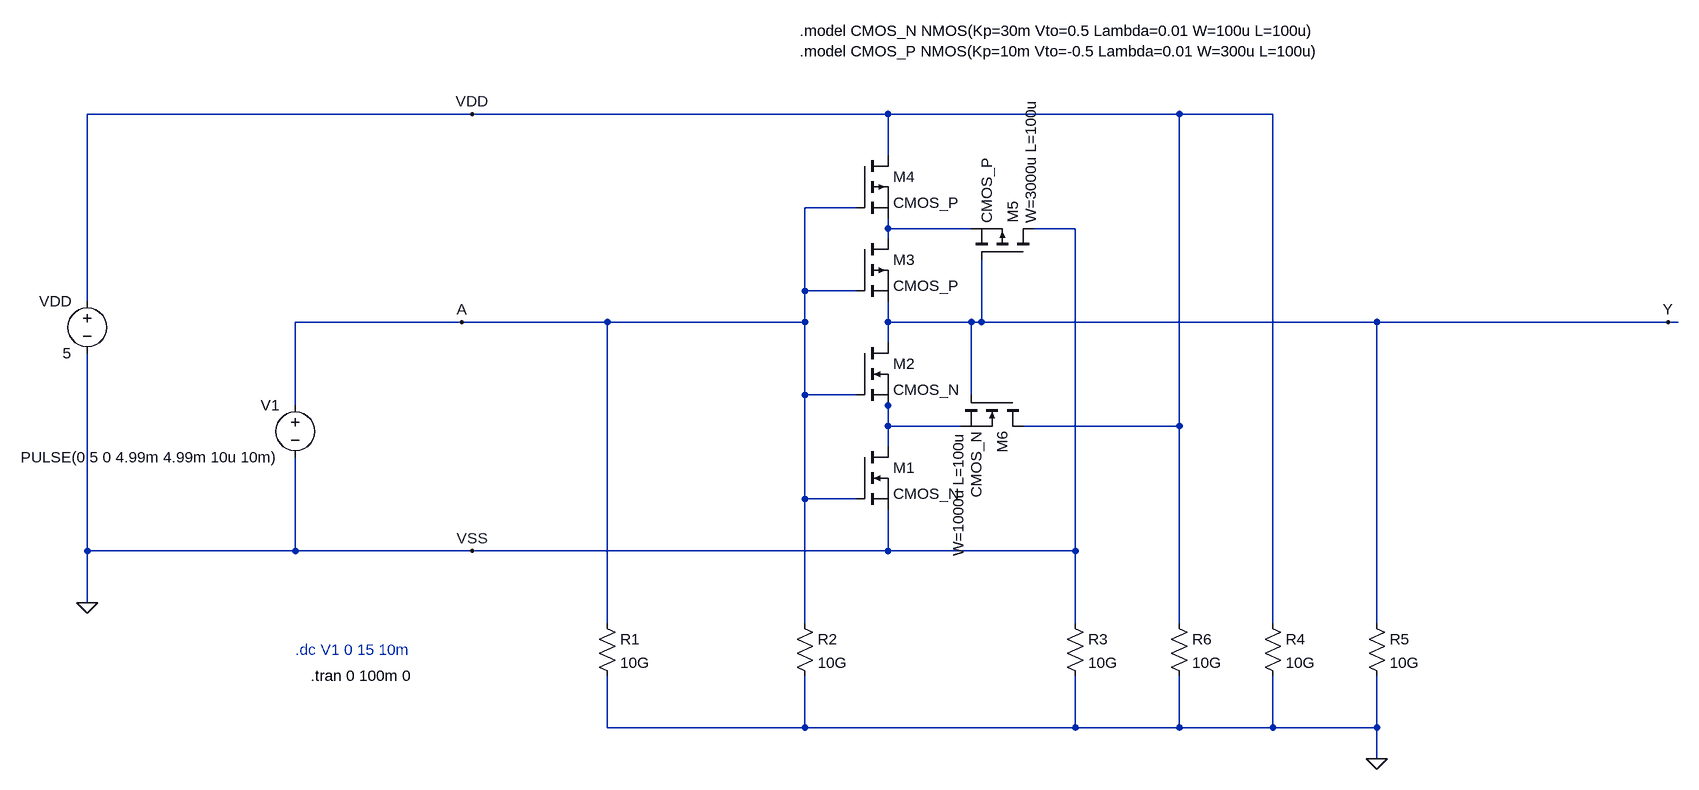
[diagram p0: schematic SN74AC14_Transistor_Level_SPICE_Model.asc]
SN74AC14_Transistor_Level_SPICE_Model.asc, the LTspice schematic file:
Version 4.1
SHEET 1 1144 756
WIRE -864 -256 -1456 -256
WIRE -224 -256 -864 -256
WIRE 224 -256 -224 -256
WIRE 368 -256 224 -256
WIRE -224 -192 -224 -256
WIRE -272 -112 -352 -112
WIRE -224 -80 -224 -96
WIRE -96 -80 -224 -80
WIRE 64 -80 0 -80
WIRE -224 -64 -224 -80
WIRE -352 16 -352 -112
WIRE -272 16 -352 16
WIRE -1456 32 -1456 -256
WIRE -880 64 -1136 64
WIRE -656 64 -880 64
WIRE -352 64 -352 16
WIRE -352 64 -656 64
WIRE -224 64 -224 32
WIRE -96 64 -224 64
WIRE -80 64 -80 -32
WIRE -80 64 -96 64
WIRE 528 64 -80 64
WIRE 976 64 528 64
WIRE 992 64 976 64
WIRE -224 96 -224 64
WIRE -352 176 -352 64
WIRE -272 176 -352 176
WIRE -96 176 -96 64
WIRE -1136 192 -1136 64
WIRE -224 192 -224 176
WIRE -224 224 -224 192
WIRE -112 224 -224 224
WIRE 224 224 224 -256
WIRE 224 224 -16 224
WIRE -224 256 -224 224
WIRE -352 336 -352 176
WIRE -272 336 -352 336
WIRE -1456 416 -1456 112
WIRE -1136 416 -1136 272
WIRE -1136 416 -1456 416
WIRE -864 416 -1136 416
WIRE -224 416 -224 352
WIRE -224 416 -864 416
WIRE 64 416 64 -80
WIRE 64 416 -224 416
WIRE -1456 496 -1456 416
WIRE -656 528 -656 64
WIRE -352 528 -352 336
WIRE 64 528 64 416
WIRE 224 528 224 224
WIRE 368 528 368 -256
WIRE 528 528 528 64
WIRE -656 688 -656 608
WIRE -352 688 -352 608
WIRE -352 688 -656 688
WIRE 64 688 64 608
WIRE 64 688 -352 688
WIRE 224 688 224 608
WIRE 224 688 64 688
WIRE 368 688 368 608
WIRE 368 688 224 688
WIRE 528 688 528 608
WIRE 528 688 368 688
WIRE 528 736 528 688
FLAG 528 736 0
FLAG -864 -256 VDD
FLAG -864 416 VSS
FLAG -880 64 A
FLAG 976 64 Y
FLAG -1456 496 0
SYMBOL nmos -272 256 R0
SYMATTR InstName M1
SYMATTR Value CMOS_N
SYMBOL nmos -272 96 R0
SYMATTR InstName M2
SYMATTR Value CMOS_N
SYMBOL pmos -272 -64 R0
SYMATTR InstName M3
SYMATTR Value CMOS_P
SYMBOL pmos -272 -192 R0
SYMATTR InstName M4
SYMATTR Value CMOS_P
SYMBOL pmos 0 -32 M270
WINDOW 39 56 4 Left 2
SYMATTR InstName M5
SYMATTR Value CMOS_P
SYMATTR SpiceLine W=3000u L=100u
SYMBOL nmos -16 176 R90
WINDOW 39 56 100 Left 2
SYMATTR InstName M6
SYMATTR Value CMOS_N
SYMATTR SpiceLine W=1000u L=100u
SYMBOL res -672 512 R0
SYMATTR InstName R1
SYMATTR Value 10G
SYMBOL res -368 512 R0
SYMATTR InstName R2
SYMATTR Value 10G
SYMBOL res 48 512 R0
SYMATTR InstName R3
SYMATTR Value 10G
SYMBOL res 352 512 R0
SYMATTR InstName R4
SYMATTR Value 10G
SYMBOL res 512 512 R0
SYMATTR InstName R5
SYMATTR Value 10G
SYMBOL res 208 512 R0
SYMATTR InstName R6
SYMATTR Value 10G
SYMBOL voltage -1136 176 M0
WINDOW 123 0 0 Left 0
WINDOW 39 0 0 Left 0
SYMATTR InstName V1
SYMATTR Value PULSE(0 5 0 4.99m 4.99m 10u 10m)
SYMBOL voltage -1456 16 M0
WINDOW 123 0 0 Left 0
WINDOW 39 0 0 Left 0
SYMATTR InstName VDD
SYMATTR Value 5
TEXT -360 -384 Left 2 !.model CMOS_N NMOS(Kp=30m Vto=0.5 Lambda=0.01 W=100u L=100u)\n.model CMOS_P NMOS(Kp=10m Vto=-0.5 Lambda=0.01 W=300u L=100u)
TEXT -1136 568 Left 2 ;.dc V1 0 15 10m
TEXT -1112 608 Left 2 !.tran 0 100m 0

The netlist it stands for:
* SN74AC14_Transistor_Level_SPICE_Model.asc
M1 N002 A 0 0 CMOS_N
M2 Y A N002 N002 CMOS_N
M3 N001 A Y Y CMOS_P
M4 VDD A N001 N001 CMOS_P
M5 0 Y N001 N001 CMOS_P W=3000u L=100u
M6 VDD Y N002 N002 CMOS_N W=1000u L=100u
R1 A 0 10G
R2 A 0 10G
R3 0 0 10G
R4 VDD 0 10G
R5 Y 0 10G
R6 VDD 0 10G
V1 A 0 PULSE(0 5 0 4.99m 4.99m 10u 10m)
VDD VDD 0 5
.model NMOS NMOS
.model PMOS PMOS
.lib standard.mos
.model CMOS_N NMOS(Kp=30m Vto=0.5 Lambda=0.01 W=100u L=100u)
.model CMOS_P NMOS(Kp=10m Vto=-0.5 Lambda=0.01 W=300u L=100u)
* .dc V1 0 15 10m
.tran 0 100m 0
.backanno
.end